# EAGLE design Baby_Monitor (EAGLE 9.6.2)
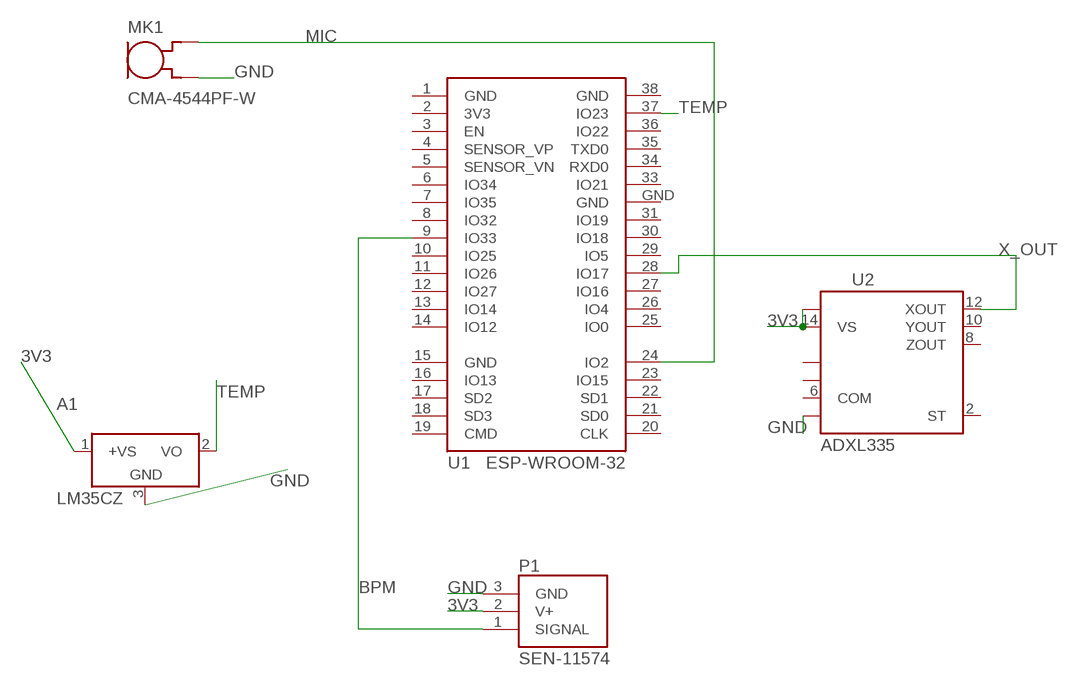
[diagram p0: schematic, sheet 1]

## Parts
A1  LM35CZ  [TO92]
MK1  CMA-4544PF-W  [MIC_CMA-4544PF-W]
P1  SEN-11574  [XDCR_SEN-11574]
U1  ESP-WROOM-32  [ESP-WROOM-32]
U2  ADXL335  [LFCSP-16]

## Nets
3V3: A1.1(+VS) P1.2(V+) U2.14(VS) U2.15(VS)
BPM: P1.1(SIGNAL) U1.9(IO33)
GND: A1.3(GND) MK1.2(GND) P1.3(GND) U2.7(COM)
MIC: MK1.1(OUT) U1.24(IO2)
TEMP: A1.2(VO) U1.37(IO23)
X_OUT: U1.28(IO17) U2.12(XOUT)
Unconnected: U1.3(EN) U1.4(SENSOR_VP) U1.5(SENSOR_VN) U1.6(IO34) U1.7(IO35) U1.8(IO32) U1.10(IO25) U1.11(IO26) U1.12(IO27) U1.13(IO14) U1.14(IO12) U1.16(IO13) U1.17(SD2) U1.18(SD3) U1.19(CMD) U1.20(CLK) U1.21(SD0) U1.22(SD1) U1.23(IO15) U1.25(IO0) U1.26(IO4) U1.27(IO16) U1.29(IO5) U1.30(IO18) U1.31(IO19) U1.33(IO21) U1.34(RXD0) U1.35(TXD0) U1.36(IO22) U2.2(ST) U2.3(COM) U2.5(COM) U2.6(COM) U2.8(ZOUT) U2.10(YOUT)

## Power pins joined to a net without a drawn wire
3V3: U1.2(3V3)
GND: U1.1(GND) U1.15(GND) U1.38(GND) U1.GND

## Library data of the parts
A1 = lm35:LM35: Single-Supply Centigrade Temperature Sensor Vout = (10mV/°C x Temp °C) +5mmmV Source: http://www.national.com/ds/LM/LM35.pdf
MK1 = CMA-4544PF-W:CMA-4544PF-W: CMA Series 9.7 mm Electret Condenser Omni-Directional Pin Mount 3 V Microphone; AVAILABILITY: Unavailable; CUI_PURCHASE_URL: https://www.cuidevices.com/product/audio/microphones/electret-condenser-microphones/cma-4544pf-w?utm_source=snapeda.com&utm_medium=referral&utm_campaign=snapedaBOM; DESCRIPTION: 9.7 mm, Omnidirectional, PCB Mount, 3.0 Vdc, Electret Condenser Microphone; MF: CUI Devices; MP: CMA-4544PF-W; PACKAGE: 6-DIP-6 CUI; PRICE: None
P1 = SEN-11574:SEN-11574: Pulse Sensor For Arduino Check prices <https://pricing.snapeda.com/parts/SEN-11574/SparkFun/view-part?ref=eda>; AVAILABILITY: Bad; DESCRIPTION: PULSE SENSOR FOR ARDUINO; MF: SparkFun; MP: SEN-11574; PACKAGE: None; PRICE: None
U1 = esp32:ESP-WROOM-32: Espressif Systems ESP-WROOM-32
U2 = ADXL335:ADXL335: 3-axis, 3g accelerometer, analog out; AVAILABILITY: Unavailable; DESCRIPTION: Accelerometer X, Y, Z Axis ±3g 1.6kHz (X,Y), 550Hz (Z) 16-LFCSP-LQ (4x4); MF: Analog Devices; MP: ADXL335; PACKAGE: LFCSP-16 Analog Devices; PRICE: None

## Net classes
1 3V3: width 0.152 mm, clearance 0.254 mm
2 SIG: width 0.152 mm, clearance 0.254 mm

## Board
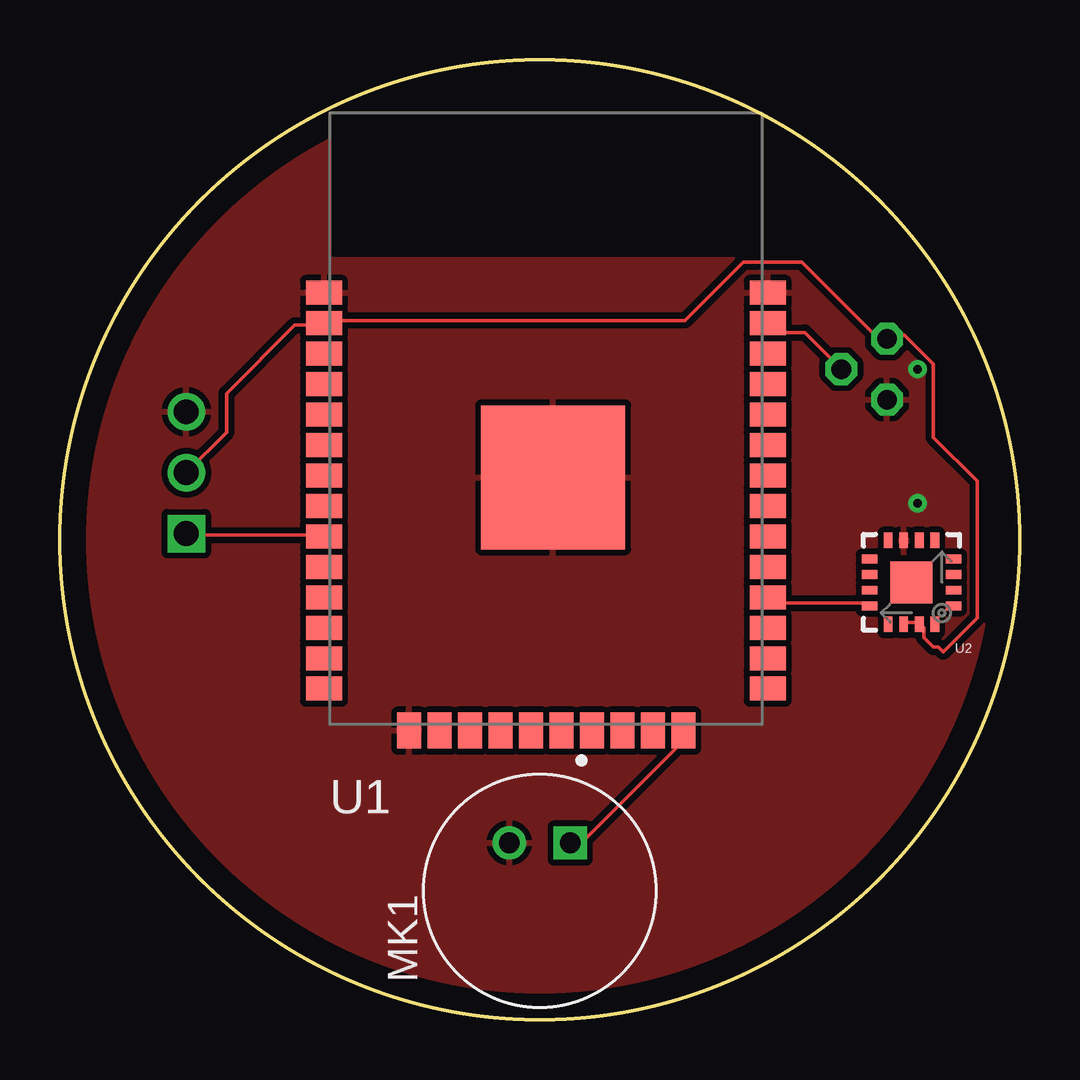
[diagram p1: board, top side]
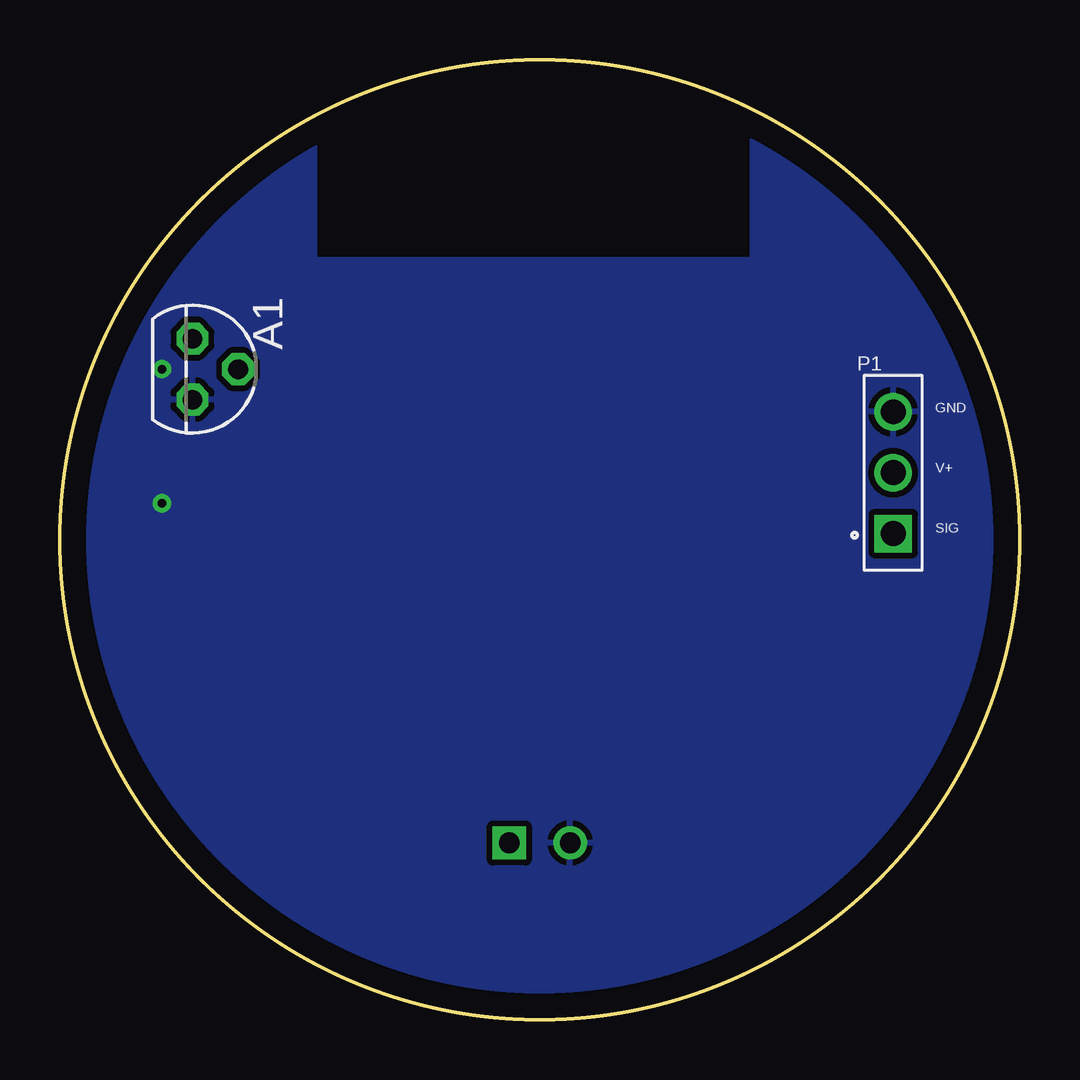
[diagram p2: board, bottom side, seen from below]

Size 40 x 40 mm. Coordinates in mm from the lower left corner, seen from the top.
Outline: circle at 20,20 radius 20
Copper layers (1*16): Top 0.035mm / dielectric 1.5mm / Bottom 0.035mm
Design rules "default *": minimum track width 6mil, minimum drill 0.35mm, track to track 10mil, track to pad 6mil, pad to pad 6mil, via to via 6mil, smd to smd 6mil, copper to edge 40mil, drill to drill 6mil, minimum pad ring 10mil, minimum via ring 8mil, stop-mask expansion 4mil, vias tented up to drill 0mil, thermal gap 10mil

### Footprints (pad centres in the part's own frame; a part is rotated, then mirrored left to right if it is on the bottom)
TO92 = drill 0.813 octagon: 1 -1.27,0; 2 0,1.905; 3 1.27,0
MIC_CMA-4544PF-W = drill 0.87 square: 1 2,-1.27 | drill 0.87: 2 2,1.27
XDCR_SEN-11574 = drill 1.04 square: 1 0,-2.54 | drill 1.04: 2 0,0; 3 0,2.54
ESP-WROOM-32 = smd 1.5 x 1: 1 -9.25,7; 2 -9.25,5.73; 3 -9.25,4.46; 4 -9.25,3.19; 5 -9.25,1.92; 6 -9.25,0.65; 7 -9.25,-0.62; 8 -9.25,-1.89; 9 -9.25,-3.16; 10 -9.25,-4.43; 11 -9.25,-5.7; 12 -9.25,-6.97; 13 -9.25,-8.24; 14 -9.25,-9.51; 25 9.25,-9.51; 26 9.25,-8.24; 27 9.25,-6.97; 28 9.25,-5.7; 29 9.25,-4.43; 30 9.25,-3.16; 31 9.25,-1.89; 32 9.25,-0.62; 33 9.25,0.65; 34 9.25,1.92; 35 9.25,3.19; 36 9.25,4.46; 37 9.25,5.73; 38 9.25,7 | smd 1 x 1.5: 15 -5.7,-11.25; 16 -4.43,-11.25; 17 -3.16,-11.25; 18 -1.89,-11.25; 19 -0.62,-11.25; 20 0.65,-11.25; 21 1.92,-11.25; 22 3.19,-11.25; 23 4.46,-11.25; 24 5.73,-11.25 | smd 6 x 6: GND 0.3,-0.7
LFCSP-16 = smd 1.75 x 1.75: 0 0,0 | smd 0.65 x 0.37: 1 -1.75,0.975; 2 -1.75,0.325; 3 -1.75,-0.325; 4 -1.75,-0.975; 9 1.75,-0.975; 10 1.75,-0.325; 11 1.75,0.325; 12 1.75,0.975 | smd 0.37 x 0.65: 5 -0.975,-1.75; 6 -0.325,-1.75; 7 0.325,-1.75; 8 0.975,-1.75; 13 0.975,1.75; 14 0.325,1.75; 15 -0.325,1.75; 16 -0.975,1.75

### Placement (x,y rotation side)
A1  34.48,27.11 270 bottom
MK1  20,5.36 90 top
P1  5.27,22.79 0 bottom
U1  20.25,23.3 0 top
U2  35.49,18.22 180 top

### Tracks (layer width: path | path; a pad name or v marks a point on that pad's centre or on a via)
3V3
  Top 0.152: P1.2 6.94,24.47 6.94,26.1 9.79,28.94 10.8,28.94 U1.2 11.01,29.14 26.05,29.14 28.48,31.58 30.92,31.58 33.97,28.53 34.38,28.53 A1.1 34.58,28.53 35.19,28.53 36.41,27.32 36.41,24.27 38.24,22.44 38.24,16.75 36.81,15.33 36.61,15.53 36.41,15.53 36,15.94 36,16.34 U2.15 35.8,16.55 35.19,16.55 U2.14
BPM
  Top 0.152: U1.9 10.8,20.2 5.32,20.2 P1.1
GND  (via drill 0.35)
  other vias: 35.75,21.52 35.75,27.11
  pour Top: 20.25,40.57 -3.11,40.57 -3.11,-2.1 41.08,-2.1 41.08,40.57
  pour Bottom: 19.75,40.83 -1.59,40.83 -1.59,-1.08 43.11,-1.08 43.11,40.83
MIC
  Top 0.152: U1.24 25.84,11.87 25.84,11.47 21.78,7.4 21.37,7.4 MK1.1
TEMP
  Top 0.152: U1.37 29.9,28.64 31.05,28.64 A1.2
X_OUT
  Top 0.152: U2.12 33.56,17.36 29.91,17.36 29.7,17.56 U1.28